# EAGLE design diagram (EAGLE 5.03)
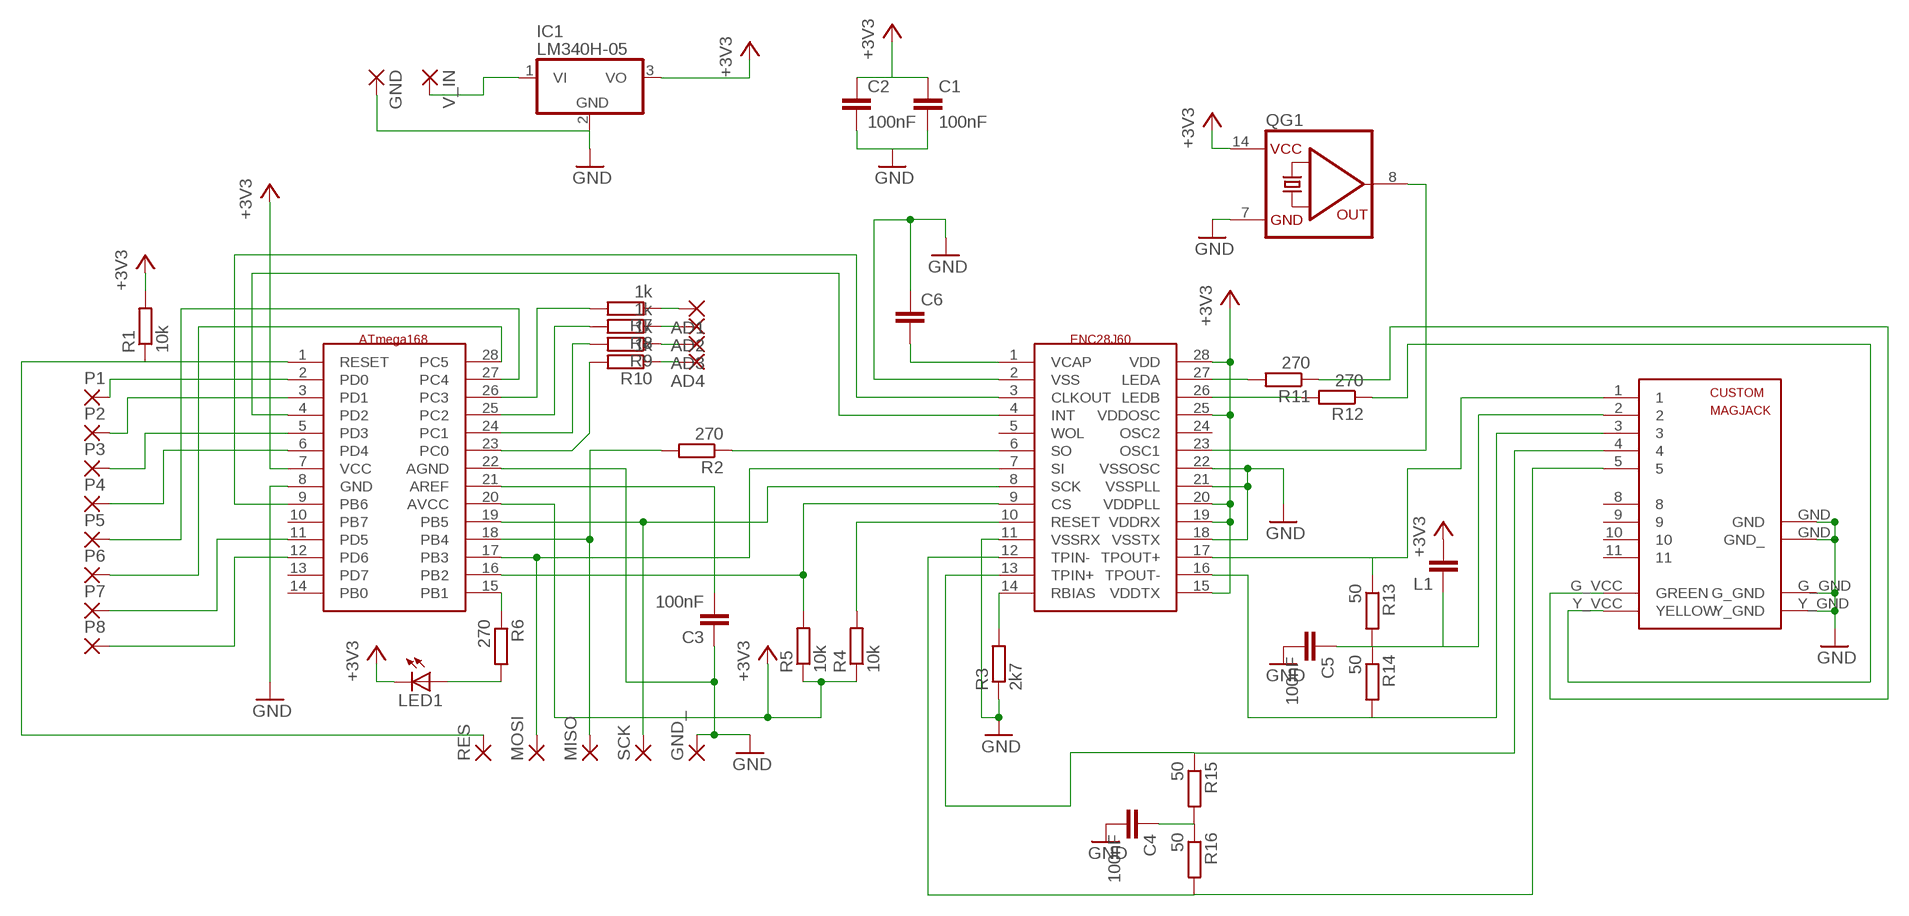
[diagram p0: schematic, sheet 1]

## Parts
AD1  2,15/1,0  [2,15/1,0]
AD2  2,15/1,0  [2,15/1,0]
AD3  2,15/1,0  [2,15/1,0]
AD4  2,15/1,0  [2,15/1,0]
C1  100nF  C-EU102-043X133  [C102-043X133]
C2  100nF  C-EU102-043X133  [C102-043X133]
C3  100nF  C-EU102-043X133  [C102-043X133]
C4  100nF  C-EU102-043X133  [C102-043X133]
C5  100nF  C-EU102-043X133  [C102-043X133]
C6  C-EU050-035X075  [C050-035X075]
GND  2,15/1,0  [2,15/1,0]
GND_  2,15/1,0  [2,15/1,0]
IC1  LM340H-05  [TO220H]
L1  C-EU050-024X044  [C050-024X044]
LED1  LED3MM  [LED3MM]
MISO  2,15/1,0  [2,15/1,0]
MOSI  2,15/1,0  [2,15/1,0]
P1  2,15/1,0  [2,15/1,0]
P2  2,15/1,0  [2,15/1,0]
P3  2,15/1,0  [2,15/1,0]
P4  2,15/1,0  [2,15/1,0]
P5  2,15/1,0  [2,15/1,0]
P6  2,15/1,0  [2,15/1,0]
P7  2,15/1,0  [2,15/1,0]
P8  2,15/1,0  [2,15/1,0]
QG1  QG5860  [DIL14S]
R1  10k  R-EU_0411/3V  [0411V]
R2  270  R-EU_0411/3V  [0411V]
R3  2k7  R-EU_0411/3V  [0411V]
R4  10k  R-EU_0411/3V  [0411V]
R5  10k  R-EU_0411/3V  [0411V]
R6  270  R-EU_0411/3V  [0411V]
R7  1k  R-EU_0411/3V  [0411V]
R8  1k  R-EU_0411/3V  [0411V]
R9  1k  R-EU_0411/3V  [0411V]
R10  1k  R-EU_0411/3V  [0411V]
R11  270  R-EU_0411/3V  [0411V]
R12  270  R-EU_0411/3V  [0411V]
R13  50  R-EU_0411/3V  [0411V]
R14  50  R-EU_0411/3V  [0411V]
R15  50  R-EU_0411/3V  [0411V]
R16  50  R-EU_0411/3V  [0411V]
RES  2,15/1,0  [2,15/1,0]
SCK  2,15/1,0  [2,15/1,0]
U$1  ATMEGA168  [ATMEGA168]
U$2  ENC28J60  [ENJ28J60]
U$3  MAGJACK  [MAGJACK]
V_IN  2,15/1,0  [2,15/1,0]

## Nets
+3V3: C1.1 C2.1 IC1.3(VO) L1.2 LED1.K(C) QG1.14(VCC) R1.2 R4.1 R5.1 U$1.7(VCC) U$1.20(AVCC) U$2.15(VDDTX) U$2.19(VDDRX) U$2.20(VDDPLL) U$2.25(VDDOSC) U$2.28(VDD)
GND: C1.2 C2.2 C3.1 C4.2 C5.2 C6.1 GND.1(P) GND_.1(P) IC1.2(GND) QG1.7(GND) R3.1 U$1.8(GND) U$1.22(AGND) U$2.2(VSS) U$2.11(VSSRX) U$2.18(VSSTX) U$2.21(VSSPLL) U$2.22(VSSOSC) U$3.G_GND U$3.GND U$3.GND_ U$3.Y_GND
N$1: SCK.1(P) U$1.19(PB5) U$2.8(SCK)
N$2: R2.1 U$2.6(SO)
N$3: MISO.1(P) R2.2 U$1.18(PB4)
N$4: MOSI.1(P) U$1.17(PB3) U$2.7(SI)
N$5: IC1.1(VI) V_IN.1(P)
N$6: R4.2 U$2.10(RESET)
N$7: R5.2 U$1.16(PB2) U$2.9(CS)
N$8: R3.2 U$2.14(RBIAS)
N$9: R1.1 RES.1(P) U$1.1(RESET)
N$10: P1.1(P) U$1.2(PD0)
N$11: P4.1(P) U$1.6(PD4)
N$12: P3.1(P) U$1.5(PD3)
N$13: P2.1(P) U$1.3(PD1)
N$14: P8.1(P) U$1.12(PD6)
N$15: P7.1(P) U$1.11(PD5)
N$16: P5.1(P) U$1.27(PC4)
N$17: P6.1(P) U$1.28(PC5)
N$18: C3.2 U$1.21(AREF)
N$19: U$1.4(PD2) U$2.4(INT)
N$20: U$1.9(PB6) U$2.3(CLKOUT)
N$21: AD1.1(P) R7.1
N$22: R6.1 U$1.15(PB1)
N$23: LED1.A R6.2
N$24: AD2.1(P) R8.1
N$25: AD3.1(P) R9.1
N$26: AD4.1(P) R10.1
N$27: R7.2 U$1.26(PC3)
N$28: R10.2 U$1.23(PC0)
N$29: R9.2 U$1.24(PC1)
N$30: R8.2 U$1.25(PC2)
N$31: C6.2 U$2.1(VCAP)
N$32: R11.1 U$3.G_VCC(GREEN)
N$33: R12.1 U$3.Y_VCC(YELLOW)
N$34: QG1.8(OUT) U$2.23(OSC1)
N$35: R11.2 U$2.27(LEDA)
N$36: R12.2 U$2.26(LEDB)
N$37: C4.1 R15.2 R16.1
N$38: C5.1 L1.1 R13.2 R14.1 U$3.2
N$39: R15.1 U$2.13(TPIN+) U$3.4
N$40: R16.2 U$2.12(TPIN-) U$3.5
N$41: R13.1 U$2.17(TPOUT+) U$3.1
N$42: R14.2 U$2.16(TPOUT-) U$3.3
Unconnected: U$1.10(PB7) U$1.13(PD7) U$1.14(PB0) U$2.5(WOL) U$2.24(OSC2) U$3.8 U$3.9 U$3.10 U$3.11

## Library data of the parts
AD1-AD4 GND GND_ MISO MOSI P1-P8 RES SCK V_IN = wirepad:2,15/1,0: THROUGH-HOLE PAD
C1-C6 L1 = rcl:C-EU: CAPACITOR, European symbol
IC1 = linear:LM340?-*: Positive VOLTAGE REGULATOR Source: http://cache.national.com/ds/LM/LM340.pdf
LED1 = led:LED: LED OSRAM: - CHIPLED LG R971, LG N971, LY N971, LG Q971, LY Q971, LO R971, LY R971 LH N974, LH R974 LS Q976, LO Q976, LY Q976 LO Q996 - Hyper CHIPLED LW Q18S LB Q993, LB Q99A, LB R99A - SideLED LS A670, LO A670, LY A670, LG A670, LP A670 LB A673, LV A673, LT A673, LW A673 LH A674 LY A675 LS A676, LA A676, LO A676, LY A676, LW A676 LS A679, LY A679, LG A679 - Hyper Micro SIDELED® LS Y876, LA Y876, LO Y876, LY Y876 LT Y87S - SmartLED LW L88C, LW L88S LB L89C, LB L89S, LG L890 LS L89K, LO L89K, LY L89K LS L896, LA L896, LO L896, LY L896 - TOPLED LS T670, LO T670, LY T670, LG T670, LP T670 LSG T670, LSP T670, LSY T670, LOP T670, LYG T670 LG T671, LOG T671, LSG T671 LB T673, LV T673, LT T673, LW T673 LH T674 LS T676, LA T676, LO T676, LY T676, LB T676, LH T676, LSB T676, LW T676 LB T67C, LV T67C, LT T67C, LS T67K, LO T67K, LY T67K, LW E67C LS E67B, LA E67B, LO E67B, LY E67B, LB E67C, LV E67C, LT E67C LW T67C LS T679, LY T679, LG T679 LS T770, LO T770, LY T770, LG T770, LP T770 LB T773, LV T773, LT T773, LW T773 LH T774 LS E675, LA E675, LY E675, LS T675 LS T776, LA T776, LO T776, LY T776, LB T776 LHGB T686 LT T68C, LB T68C - Hyper Mini TOPLED® LB M676 - Mini TOPLED Santana® LG M470 LS M47K, LO M47K, LY M47K Source: http://www.osram.convergy.de - LUMILED® LXK2-PW12-R00, LXK2-PW12-S00, LXK2-PW14-U00, LXK2-PW14-V00 LXK2-PM12-R00, LXK2-PM12-S00, LXK2-PM14-U00 LXK2-PE12-Q00, LXK2-PE12-R00, LXK2-PE12-S00, LXK2-PE14-T00, LXK2-PE14-U00 LXK2-PB12-K00, LXK2-PB12-L00, LXK2-PB12-M00, LXK2-PB14-N00, LXK2-PB14-P00, LXK2-PB14-Q00 LXK2-PR12-L00, LXK2-PR12-M00, LXK2-PR14-Q00, LXK2-PR14-R00 LXK2-PD12-Q00, LXK2-PD12-R00, LXK2-PD12-S00 LXK2-PH12-R00, LXK2-PH12-S00 LXK2-PL12-P00, LXK2-PL12-Q00, LXK2-PL12-R00 Source: www.luxeon.com
QG1 = crystal:QG5860: CRYSTAL RESONATOR
R1-R16 = rcl:R-EU_: RESISTOR, European symbol
U$1 = mylib:ATMEGA168
U$2 = mylib:ENC28J60
U$3 = mylib:MAGJACK

## Board
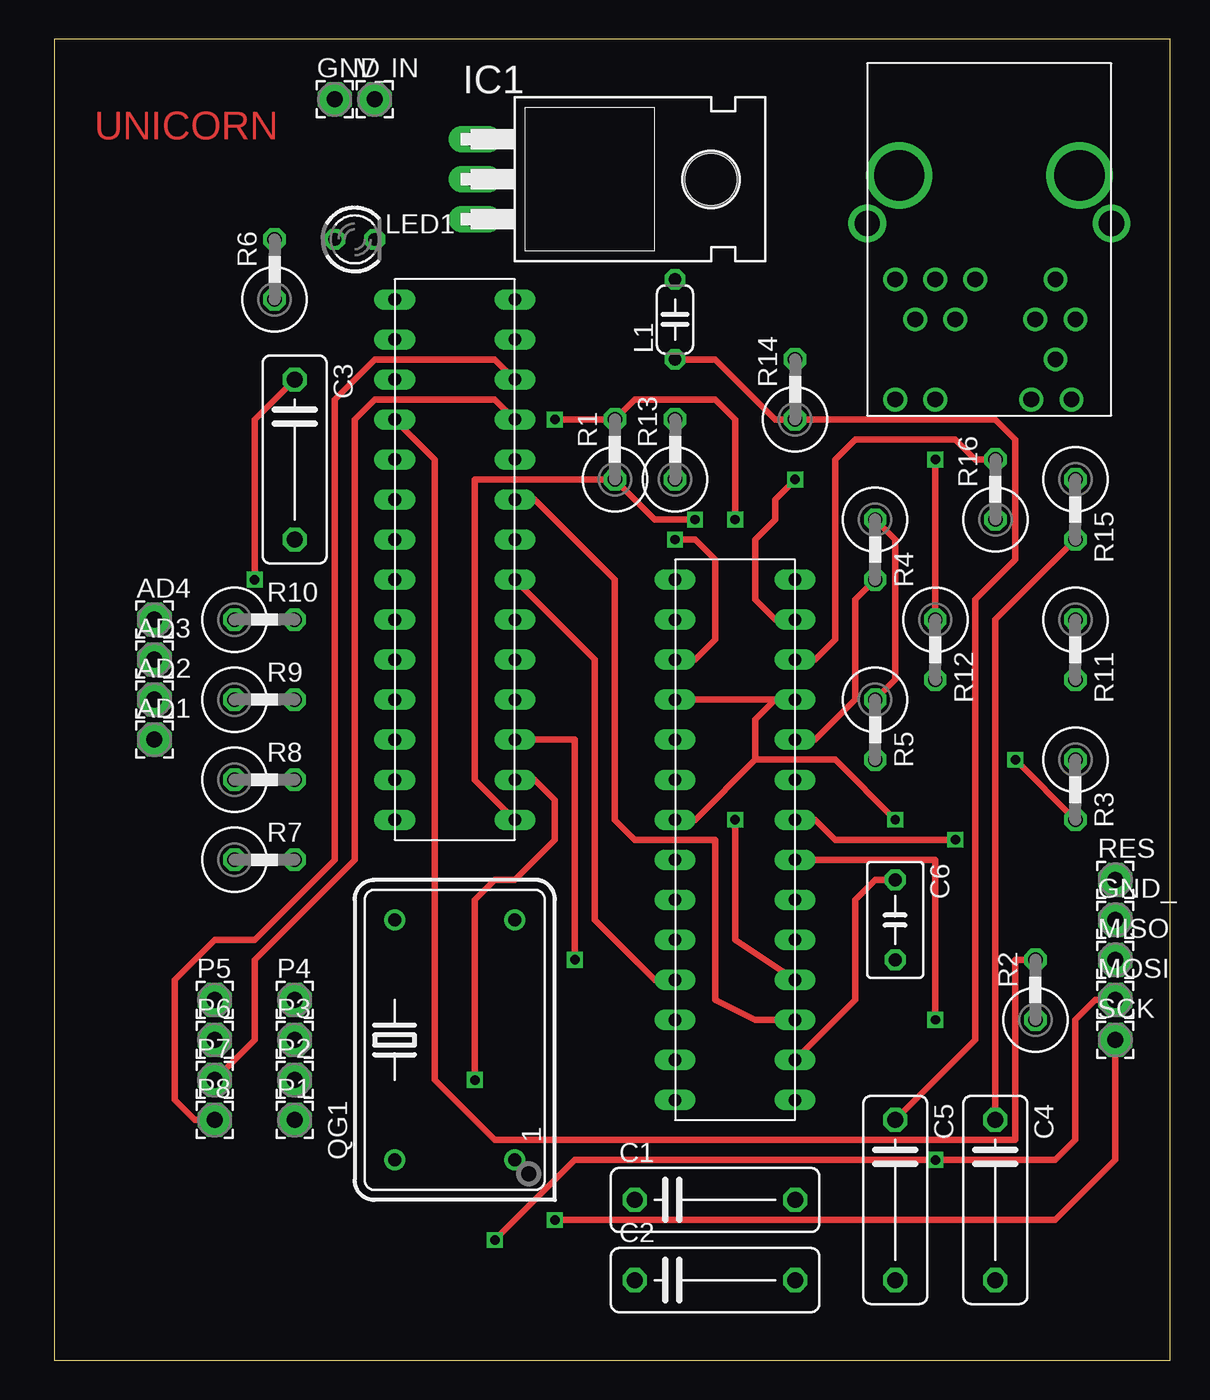
[diagram p1: board, top side]
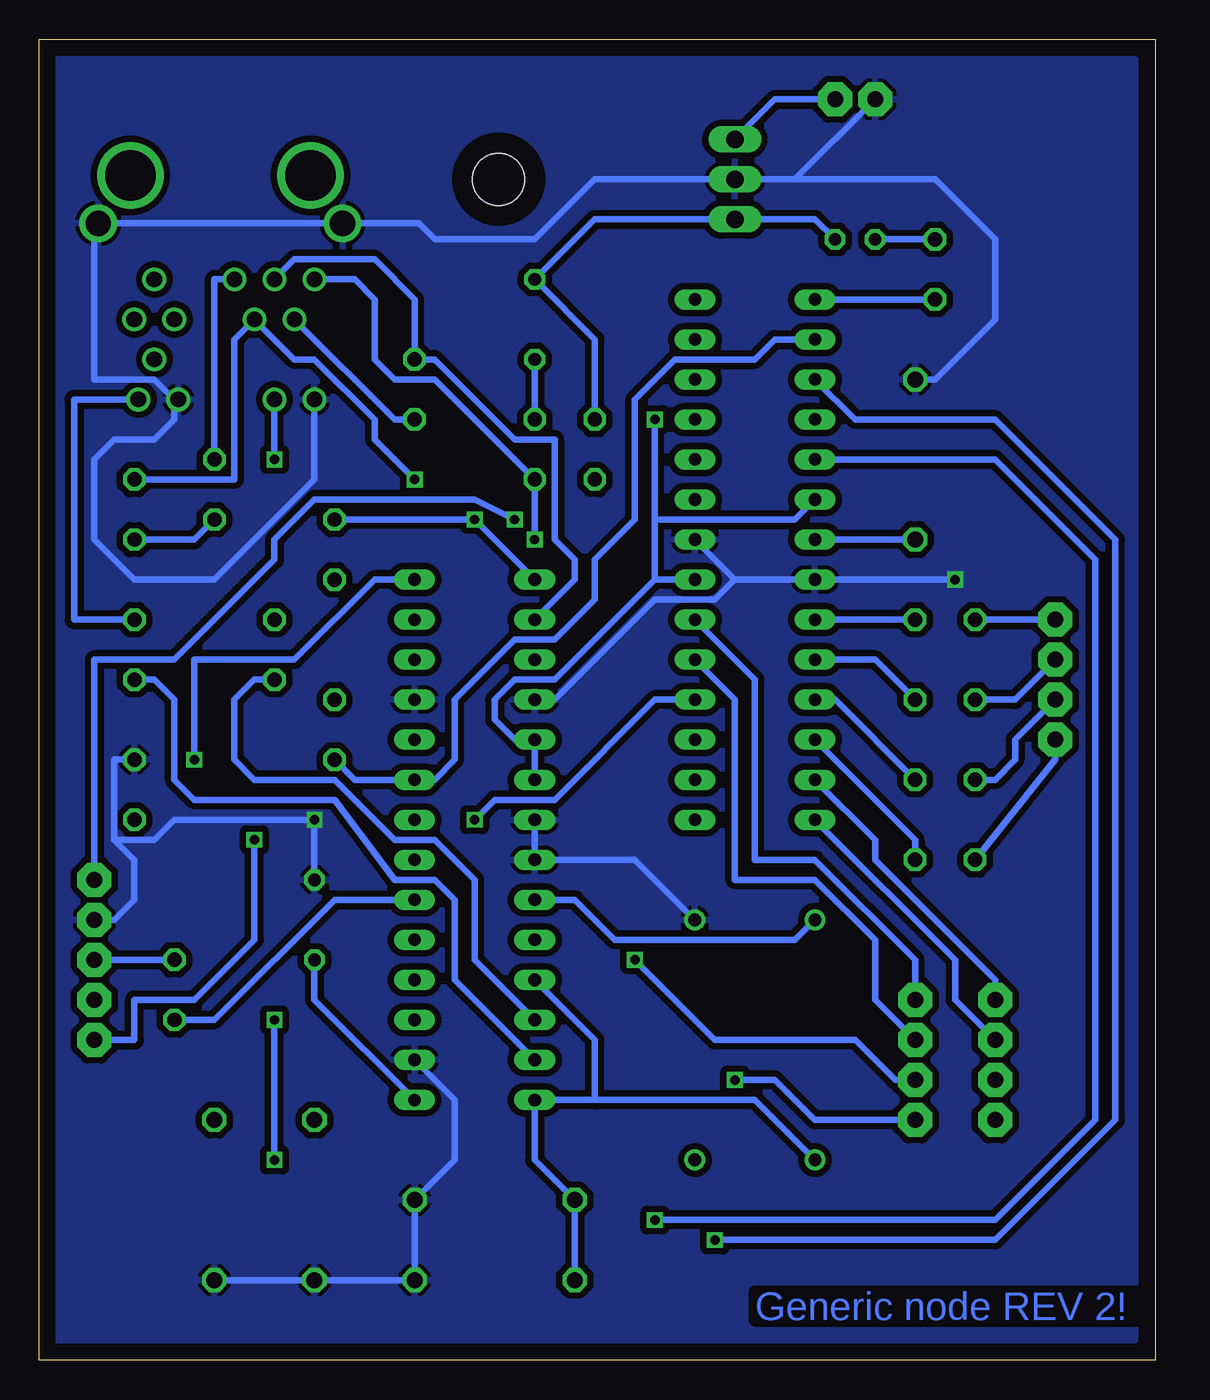
[diagram p2: board, bottom side, seen from below]

Size 70.79 x 83.81 mm. Coordinates in mm from the lower left corner, seen from the top.
Outline: 0,0 70.79,0 70.79,83.81 0,83.81 0,0
Copper layers (1*16): Top 0.035mm / dielectric 1.5mm / Bottom 0.035mm
Design rules "default": minimum track width 10mil, minimum drill 24mil, track to track 8mil, track to pad 8mil, pad to pad 8mil, via to via 8mil, smd to smd 8mil, copper to edge 40mil, drill to drill 8mil, minimum pad ring 10mil, minimum via ring 8mil, stop-mask expansion 4mil, vias tented up to drill 0mil, thermal gap 10mil

### Footprints (pad centres in the part's own frame; a part is rotated, then mirrored left to right if it is on the bottom)
2,15/1,0 = drill 1.016 pad 2.159 octagon: 1 0,0
C102-043X133 = drill 1.016 octagon: 1 -5.08,0; 2 5.08,0
C050-035X075 = drill 0.813 octagon: 1 -2.54,0; 2 2.54,0
TO220H = drill 1.118 long: 1 -2.54,-10.16; 2 0,-10.16; 3 2.54,-10.16 | hole 3.302: 0,4.826
C050-024X044 = drill 0.813 octagon: 1 -2.54,0; 2 2.54,0
LED3MM = drill 0.813 octagon: A -1.27,0; K 1.27,0
DIL14S = drill 0.813 round: 1 -7.62,-3.81; 7 7.62,-3.81; 8 7.62,3.81; 14 -7.62,3.81
0411V = drill 0.914 octagon: 1 -2.54,0; 2 1.27,0
ATMEGA168 = drill 0.8 long: 1 -6.35,15.24; 2 -6.35,12.7; 3 -6.35,10.16; 4 -6.35,7.62; 5 -6.35,5.08; 6 -6.35,2.54; 7 -6.35,0; 8 -6.35,-2.54; 9 -6.35,-5.08; 10 -6.35,-7.62; 11 -6.35,-10.16; 12 -6.35,-12.7; 13 -6.35,-15.24; 14 -6.35,-17.78; 15 1.27,-17.78; 16 1.27,-15.24; 17 1.27,-12.7; 18 1.27,-10.16; 19 1.27,-7.62; 20 1.27,-5.08; 21 1.27,-2.54; 22 1.27,0; 23 1.27,2.54; 24 1.27,5.08; 25 1.27,7.62; 26 1.27,10.16; 27 1.27,12.7; 28 1.27,15.24
ENJ28J60 = drill 0.8 long: 1 -5.08,8.89; 2 -5.08,6.35; 3 -5.08,3.81; 4 -5.08,1.27; 5 -5.08,-1.27; 6 -5.08,-3.81; 7 -5.08,-6.35; 8 -5.08,-8.89; 9 -5.08,-11.43; 10 -5.08,-13.97; 11 -5.08,-16.51; 12 -5.08,-19.05; 13 -5.08,-21.59; 14 -5.08,-24.13; 15 2.54,-24.13; 16 2.54,-21.59; 17 2.54,-19.05; 18 2.54,-16.51; 19 2.54,-13.97; 20 2.54,-11.43; 21 2.54,-8.89; 22 2.54,-6.35; 23 2.54,-3.81; 24 2.54,-1.27; 25 2.54,1.27; 26 2.54,3.81; 27 2.54,6.35; 28 2.54,8.89
MAGJACK = drill 1 round: 1 -3.81,2.54; 2 -2.54,0; 3 -1.27,2.54; 4 0,0; 5 1.27,2.54; 8 5.08,0; 9 6.35,2.54; 10 7.62,0; 11 6.35,-2.54; G_GND 4.826,-5.08; G_VCC 7.366,-5.08; Y_GND -3.81,-5.08; Y_VCC -1.27,-5.08 | drill 1.6 round: GND -5.588,6.096; GND_ 9.906,6.096 | drill 3.2 round: P$14 7.874,9.144; P$15 -3.556,9.144

### Placement (x,y rotation side)
AD1  6.35,39.37 0 top
AD2  6.35,41.91 0 top
AD3  6.35,44.45 0 top
AD4  6.35,46.99 0 top
C1  41.91,10.16 0 top
C2  41.91,5.08 0 top
C3  15.24,57.15 270 top
C4  59.69,10.16 270 top
C5  53.34,10.16 270 top
C6  53.34,27.94 270 top
GND  17.78,80.01 0 top
GND_  67.31,27.94 0 top
IC1  36.83,74.93 270 top
L1  39.37,66.04 90 top
LED1  19.05,71.12 0 top
MISO  67.31,25.4 0 top
MOSI  67.31,22.86 0 top
P1  15.24,15.24 0 top
P2  15.24,17.78 0 top
P3  15.24,20.32 0 top
P4  15.24,22.86 0 top
P5  10.16,22.86 0 top
P6  10.16,20.32 0 top
P7  10.16,17.78 0 top
P8  10.16,15.24 0 top
QG1  25.4,20.32 90 top
R1  35.56,58.42 90 top
R2  62.23,24.13 90 top
R3  64.77,35.56 270 top
R4  52.07,50.8 270 top
R5  52.07,39.37 270 top
R6  13.97,69.85 90 top
R7  13.97,31.75 0 top
R8  13.97,36.83 0 top
R9  13.97,41.91 0 top
R10  13.97,46.99 0 top
R11  64.77,44.45 270 top
R12  55.88,44.45 270 top
R13  39.37,58.42 90 top
R14  46.99,62.23 90 top
R15  64.77,53.34 270 top
R16  59.69,55.88 90 top
RES  67.31,30.48 0 top
SCK  67.31,20.32 0 top
U$1  22.86,49.53 180 top
U$2  41.91,25.4 180 top
U$3  57.15,66.04 0 top
V_IN  20.32,80.01 0 top

### Tracks (layer width: path | path; a pad name or v marks a point on that pad's centre or on a via)
+3V3  (via drill 0.6)
  Top 0.406: v43.18,53.34 43.18,59.69 41.91,60.96 36.83,60.96 R1.2 v31.75,59.69 | R4.1 53.34,52.07 53.34,43.18 R5.1 | U$2.25 38.1,24.13 34.29,27.94 34.29,44.45 U$1.7
  Bottom 0.406: C2.1 C1.1 39.37,12.7 U$2.28 35.56,16.51 | 35.56,16.51 25.4,16.51 QG1.14 | LED1.K 21.59,72.39 IC1.3 35.56,72.39 L1.2 35.56,64.77 R1.2 | R4.1 v43.18,53.34 U$2.15 | U$2.25 35.56,20.32 35.56,16.51 | U$1.7 31.75,49.53 | 31.75,49.53 31.75,53.34 | 31.75,53.34 22.86,53.34 U$1.20 | 31.75,53.34 v31.75,59.69 | U$2.20 U$2.19 40.64,39.37 41.91,40.64 41.91,41.91 40.64,43.18 38.1,43.18 31.75,49.53
GND  (via drill 0.6)
  Top 0.406: C6.1 52.07,30.48 50.8,29.21 50.8,22.86 U$2.2 | v53.34,34.29 49.53,38.1 44.45,38.1 | 44.45,38.1 44.45,40.64 45.72,41.91 U$2.11 U$2.18 | U$2.21 40.64,34.29 44.45,38.1 | v12.7,49.53 12.7,59.69 C3.1
  Bottom 0.406: C4.2 C5.2 C2.2 C1.2 44.45,12.7 44.45,16.51 U$2.2 | QG1.7 33.02,31.75 U$2.22 U$2.21 | 22.86,74.93 GND.1 | 22.86,74.93 IC1.2 35.56,74.93 39.37,71.12 45.72,71.12 46.74,72.14 U$3.GND U$3.GND_ 67.31,71.88 67.31,62.23 63.5,62.23 62.23,60.96 U$3.G_GND 62.23,60.71 62.23,59.69 63.5,58.42 66.04,58.42 67.31,57.15 67.31,52.07 64.77,49.53 59.69,49.53 53.34,55.88 U$3.Y_GND | C3.1 13.97,62.23 10.16,66.04 10.16,71.12 13.97,74.93 22.86,74.93 | C6.1 v53.34,34.29 62.23,34.29 63.5,33.02 66.04,33.02 | R3.1 66.04,38.1 66.04,33.02 | 66.04,33.02 64.77,31.75 64.77,29.21 66.04,27.94 GND_.1 | 26.67,49.53 U$1.22 v12.7,49.53 | 26.67,49.53 U$1.8 | U$2.18 38.1,41.91 31.75,48.26 27.94,48.26 26.67,49.53
  pour Bottom (isolate 0.406): 1.27,82.55 1.27,1.27 69.85,1.27 69.85,82.55
N$1  (via drill 0.6)
  Top 0.406: U$2.8 48.26,34.29 49.53,33.02 v57.15,33.02 | v31.75,8.89 63.5,8.89 67.31,12.7 SCK.1
  Bottom 0.406: U$1.19 10.16,57.15 3.81,50.8 3.81,15.24 10.16,8.89 v31.75,8.89 | SCK.1 64.77,20.32 64.77,22.86 60.96,22.86 57.15,26.67 v57.15,33.02
N$2
  Bottom 0.406: R2.1 59.69,21.59 52.07,29.21 U$2.6
N$3
  Top 0.406: R2.2 60.96,25.4 60.96,13.97 27.94,13.97 24.13,17.78 24.13,57.15 U$1.18
  Bottom 0.406: R2.2 MISO.1
N$4  (via drill 0.6)
  Top 0.406: MOSI.1 66.04,22.86 64.77,21.59 64.77,13.97 63.5,12.7 v55.88,12.7 33.02,12.7 v27.94,7.62 | U$2.7 55.88,31.75 v55.88,21.59
  Bottom 0.406: U$1.17 19.05,59.69 10.16,59.69 2.54,52.07 2.54,15.24 10.16,7.62 v27.94,7.62 | v55.88,12.7 v55.88,21.59
N$5
  Bottom 0.406: IC1.1 24.13,80.01 V_IN.1
N$6
  Top 0.406: U$2.10 48.26,39.37 50.8,41.91 50.8,48.26 R4.2
N$7
  Bottom 0.406: U$1.16 24.13,64.77 25.4,63.5 30.48,63.5 33.02,60.96 33.02,53.34 35.56,50.8 35.56,48.26 38.1,45.72 40.64,45.72 44.45,41.91 44.45,38.1 45.72,36.83 U$2.9 50.8,36.83 R5.2
N$8  (via drill 0.6)
  Top 0.406: v60.96,38.1 R3.2
  Bottom 0.406: U$2.14 49.53,49.53 54.61,44.45 60.96,44.45 v60.96,38.1
N$9  (via drill 0.6)
  Top 0.406: v40.64,53.34 38.1,53.34 R1.1 26.67,55.88 26.67,36.83 U$1.1
  Bottom 0.406: RES.1 67.31,44.45 62.23,44.45 55.88,50.8 55.88,52.07 54.61,53.34 53.34,54.61 43.18,54.61 v40.64,53.34
N$10  (via drill 0.6)
  Top 0.406: v26.67,17.78 26.67,29.21 27.94,30.48 29.21,30.48 31.75,33.02 31.75,35.56 30.48,36.83 U$1.2
  Bottom 0.406: P1.1 21.59,15.24 24.13,17.78 v26.67,17.78
N$11
  Bottom 0.406: P4.1 15.24,25.4 21.59,31.75 25.4,31.75 25.4,43.18 U$1.6
N$12
  Bottom 0.406: U$1.5 26.67,41.91 26.67,30.48 21.59,30.48 17.78,26.67 17.78,22.86 P3.1
N$13  (via drill 0.6)
  Top 0.406: v33.02,25.4 33.02,39.37 U$1.3
  Bottom 0.406: P2.1 16.51,17.78 19.05,20.32 27.94,20.32 v33.02,25.4
N$14
  Top 0.406: P8.1 8.89,15.24 7.62,16.51 7.62,24.13 10.16,26.67 12.7,26.67 17.78,31.75 17.78,60.96 20.32,63.5 27.94,63.5 U$1.12
N$15
  Top 0.406: P7.1 12.7,20.32 12.7,25.4 19.05,31.75 19.05,59.69 20.32,60.96 27.94,60.96 U$1.11
N$16
  Bottom 0.406: P5.1 10.16,24.13 17.78,31.75 17.78,33.02 U$1.27
N$17
  Bottom 0.406: U$1.28 12.7,25.4 12.7,22.86 P6.1
N$18
  Bottom 0.406: C3.2 U$1.21
N$19  (via drill 0.6)
  Top 0.406: v43.18,34.29 43.18,26.67 U$2.4
  Bottom 0.406: U$1.4 31.75,41.91 38.1,35.56 41.91,35.56 v43.18,34.29
N$20
  Top 0.406: U$2.3 44.45,21.59 41.91,22.86 41.91,33.02 36.83,33.02 35.56,34.29 35.56,49.53 30.48,54.61 U$1.9
N$21
  Bottom 0.406: R7.1 6.35,38.1 AD1.1
N$22
  Bottom 0.406: R6.1 U$1.15
N$23
  Bottom 0.406: LED1.A R6.2
N$24
  Bottom 0.406: AD2.1 8.89,39.37 8.89,38.1 10.16,36.83 R8.1
N$25
  Bottom 0.406: AD3.1 8.89,41.91 R9.1
N$26
  Bottom 0.406: R10.1 AD4.1
N$27
  Bottom 0.406: U$1.26 15.24,33.02 R7.2
N$28
  Bottom 0.406: R10.2 U$1.23
N$29
  Bottom 0.406: R9.2 17.78,44.45 U$1.24
N$30
  Bottom 0.406: R8.2 20.32,41.91 U$1.25
N$31
  Bottom 0.406: C6.2 53.34,22.86 U$2.1
N$32
  Bottom 0.406: U$3.G_VCC 68.58,60.96 68.58,46.99 R11.1
N$33  (via drill 0.6)
  Top 0.406: R12.1 v55.88,57.15
  Bottom 0.406: v55.88,57.15 U$3.Y_VCC
N$34
  Bottom 0.406: QG1.8 22.86,26.67 34.29,26.67 36.83,29.21 U$2.23
N$35
  Bottom 0.406: U$2.27 44.45,24.13 44.45,29.21 45.72,30.48 48.26,30.48 52.07,35.56 60.96,35.56 62.23,36.83 62.23,41.91 63.5,43.18 R11.2
N$36
  Bottom 0.406: U$2.26 43.18,25.4 43.18,30.48 45.72,33.02 48.26,33.02 52.07,36.83 57.15,36.83 58.42,38.1 58.42,41.91 57.15,43.18 R12.2
N$37
  Top 0.406: C4.1 59.69,46.99 R15.2
  Bottom 0.406: R15.2 60.96,52.07 R16.1
N$38
  Top 0.406: L1.1 41.91,63.5 45.72,59.69 R14.1 59.69,59.69 60.96,58.42 60.96,50.8 58.42,48.26 58.42,20.32 C5.1
  Bottom 0.406: U$3.2 48.26,59.69 R14.1 | L1.1 R13.2
N$39  (via drill 0.6)
  Top 0.406: v46.99,55.88 45.72,54.61 45.72,53.34 44.45,52.07 44.45,48.26 45.72,46.99 U$2.13
  Bottom 0.406: R15.1 58.42,55.88 58.42,64.77 U$3.4 54.61,63.5 53.34,63.5 49.53,59.69 49.53,58.42 v46.99,55.88
N$40
  Top 0.406: R16.2 58.42,57.15 57.15,58.42 50.8,58.42 49.53,57.15 49.53,45.72 48.26,44.45 U$2.12
  Bottom 0.406: U$3.5 59.69,68.58 R16.2
N$41  (via drill 0.6)
  Top 0.406: v39.37,52.07 40.64,52.07 41.91,50.8 41.91,45.72 40.64,44.45 U$2.17
  Bottom 0.406: U$3.1 50.8,68.58 49.53,67.31 49.53,63.5 48.26,62.23 45.72,62.23 R13.1 v39.37,52.07
N$42
  Bottom 0.406: U$3.3 54.61,69.85 49.53,69.85 46.99,67.31 R14.2 45.72,63.5 40.64,58.42 38.1,58.42 38.1,52.07 36.83,50.8 36.83,49.53 U$2.16

### Text on the board
Top: UNICORN
Bottom: Generic node REV 2!